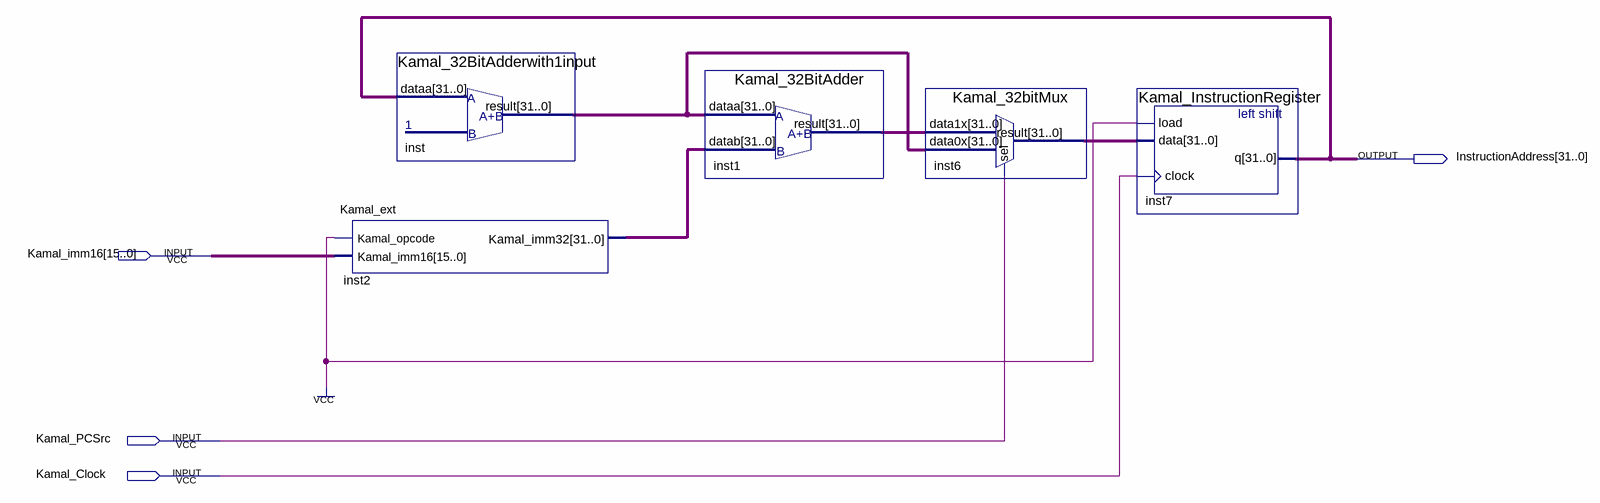
[diagram p0: schematic sheet]
// Quartus schematic Kamal_InstructionFetch.bdf as structural Verilog: 5 symbols, 4 pins
module Kamal_InstructionFetch (
  input  [15:0] Kamal_imm16,
  input  Kamal_PCSrc,
  input  Kamal_Clock,
  output [31:0] InstructionAddress
);

  wire [31:0] inst1_result, inst2_kamal_imm32, inst6_result, inst_result;

  Kamal_32BitAdderwith1input inst (.dataa(InstructionAddress), .result(inst_result));
  Kamal_ext inst2 (.Kamal_opcode(1'b1), .Kamal_imm16(Kamal_imm16), .Kamal_imm32(inst2_kamal_imm32));
  Kamal_32BitAdder inst1 (.dataa(inst_result), .datab(inst2_kamal_imm32), .result(inst1_result));
  Kamal_32bitMux inst6 (.data1x(inst1_result), .data0x(inst_result), .sel(Kamal_PCSrc), .result(inst6_result));
  Kamal_InstructionRegister inst7 (.load(1'b1), .data(inst6_result), .clock(Kamal_Clock), .q(InstructionAddress));
endmodule
